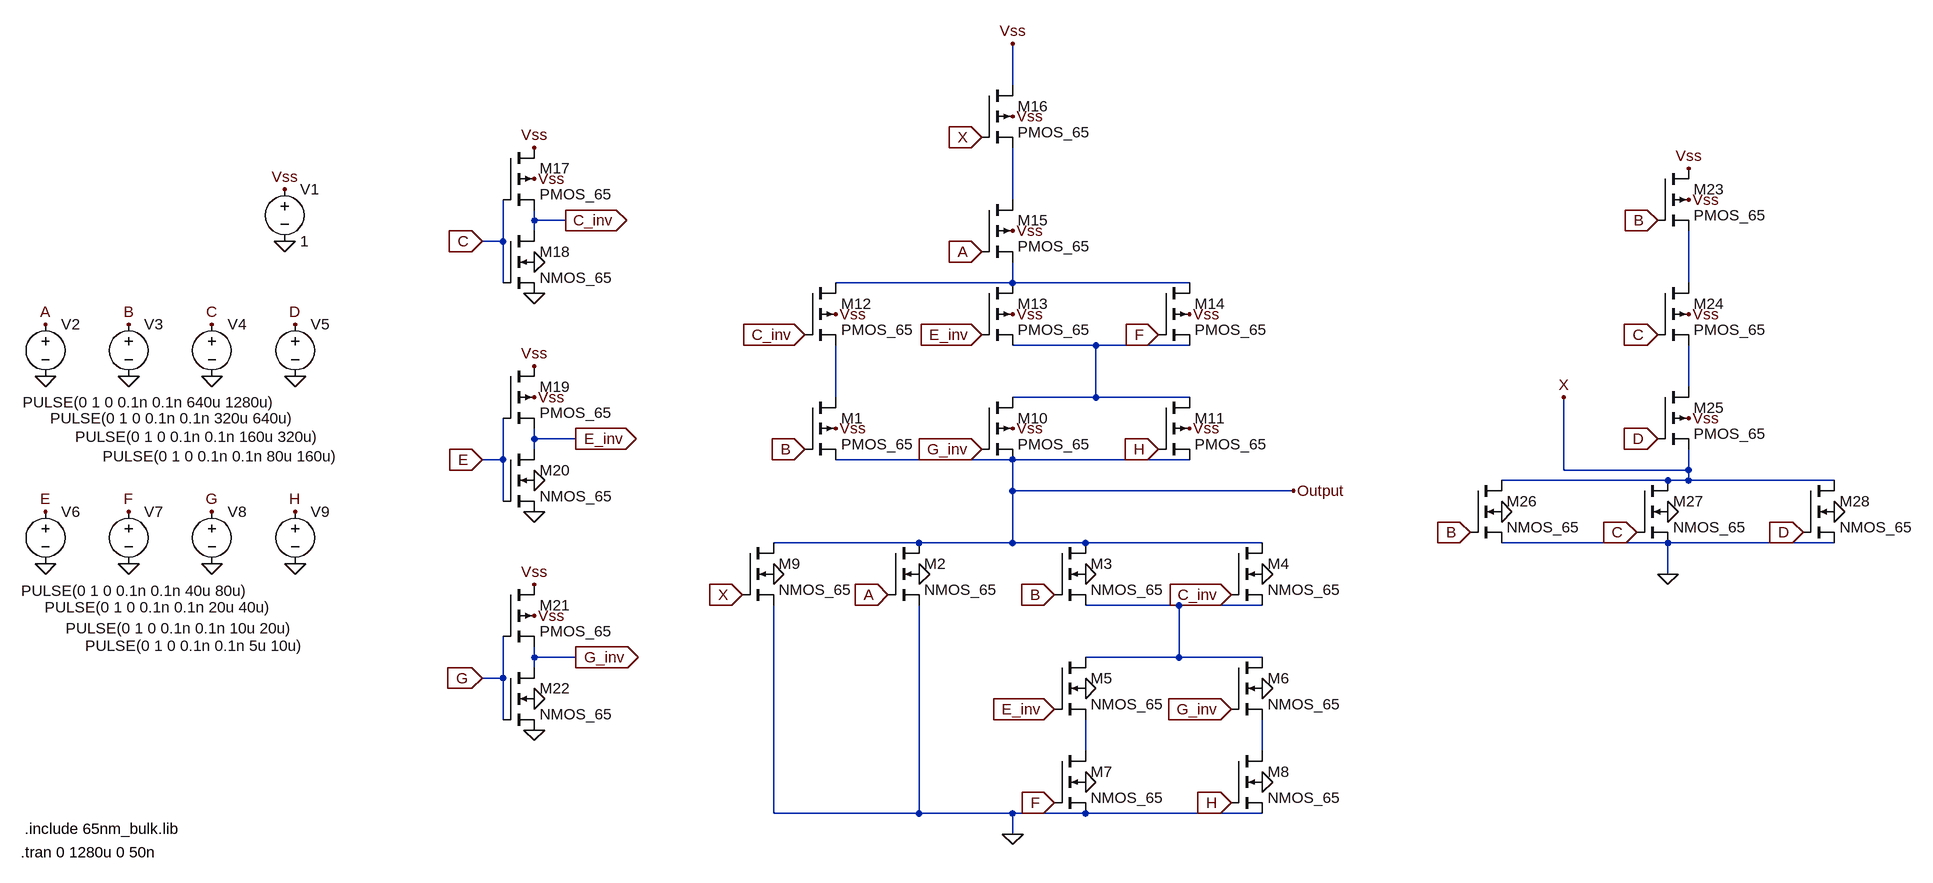
[diagram p0: schematic t_case1.asc]
t_case1.asc, the LTspice schematic file:
Version 4
SHEET 1 1728 924
WIRE 336 -272 336 -336
WIRE 336 -96 336 -176
WIRE -400 -64 -400 -80
WIRE -352 -64 -400 -64
WIRE -400 -48 -400 -64
WIRE -448 -32 -448 -96
WIRE -448 -32 -480 -32
WIRE -448 32 -448 -32
WIRE 336 32 336 0
WIRE 336 32 64 32
WIRE 608 32 336 32
WIRE 1376 32 1376 -48
WIRE 464 128 336 128
WIRE 608 128 464 128
WIRE 1376 192 1376 128
WIRE 64 208 64 128
WIRE 464 208 464 128
WIRE 464 208 336 208
WIRE 608 208 464 208
WIRE -400 272 -400 256
WIRE -336 272 -400 272
WIRE -400 288 -400 272
WIRE -448 304 -448 240
WIRE -448 304 -480 304
WIRE 336 304 64 304
WIRE 608 304 336 304
WIRE 1184 320 1184 208
WIRE 1376 320 1376 288
WIRE 1376 320 1184 320
WIRE 1344 336 1088 336
WIRE 1376 336 1376 320
WIRE 1376 336 1344 336
WIRE 1600 336 1376 336
WIRE 336 352 336 304
WIRE 768 352 336 352
WIRE -448 368 -448 304
WIRE 192 432 -32 432
WIRE 336 432 336 352
WIRE 336 432 192 432
WIRE 448 432 336 432
WIRE 720 432 448 432
WIRE 1344 432 1088 432
WIRE 1600 432 1344 432
WIRE 1344 480 1344 432
WIRE 592 528 448 528
WIRE 720 528 592 528
WIRE -400 608 -400 592
WIRE -336 608 -400 608
WIRE 592 608 592 528
WIRE 592 608 448 608
WIRE 720 608 592 608
WIRE -400 624 -400 608
WIRE -448 640 -448 576
WIRE -448 640 -480 640
WIRE -448 704 -448 640
WIRE 448 752 448 704
WIRE 720 752 720 704
WIRE -32 848 -32 528
WIRE 192 848 192 528
WIRE 192 848 -32 848
WIRE 336 848 192 848
WIRE 448 848 336 848
WIRE 720 848 448 848
WIRE 336 880 336 848
FLAG 64 256 Vss
FLAG 16 288 B
IOPIN 16 288 In
FLAG 192 480 0
FLAG 144 512 A
IOPIN 144 512 In
FLAG 448 480 0
FLAG 400 512 B
IOPIN 400 512 In
FLAG 720 480 0
FLAG 672 512 C_inv
IOPIN 672 512 In
FLAG 448 656 0
FLAG 400 688 E_inv
IOPIN 400 688 In
FLAG 720 656 0
FLAG 672 688 G_inv
IOPIN 672 688 In
FLAG 448 800 0
FLAG 400 832 F
IOPIN 400 832 In
FLAG 720 800 0
FLAG 672 832 H
IOPIN 672 832 In
FLAG -32 480 0
FLAG -80 512 X
IOPIN -80 512 In
FLAG 336 880 0
FLAG 336 256 Vss
FLAG 288 288 G_inv
IOPIN 288 288 In
FLAG 608 256 Vss
FLAG 560 288 H
IOPIN 560 288 In
FLAG 64 80 Vss
FLAG 16 112 C_inv
IOPIN 16 112 In
FLAG 336 80 Vss
FLAG 288 112 E_inv
IOPIN 288 112 In
FLAG 608 80 Vss
FLAG 560 112 F
IOPIN 560 112 In
FLAG 336 -48 Vss
FLAG 288 -16 A
IOPIN 288 -16 In
FLAG 336 -224 Vss
FLAG 288 -192 X
IOPIN 288 -192 In
FLAG -400 -128 Vss
FLAG -400 0 0
FLAG 336 -336 Vss
FLAG -400 -176 Vss
FLAG -400 48 0
FLAG -480 -32 C
IOPIN -480 -32 In
FLAG -400 208 Vss
FLAG -400 336 0
FLAG -400 160 Vss
FLAG -400 384 0
FLAG -480 304 E
IOPIN -480 304 In
FLAG -400 544 Vss
FLAG -400 672 0
FLAG -400 496 Vss
FLAG -400 720 0
FLAG -480 640 G
IOPIN -480 640 In
FLAG 1376 -96 Vss
FLAG 1328 -64 B
IOPIN 1328 -64 In
FLAG 1376 80 Vss
FLAG 1328 112 C
IOPIN 1328 112 In
FLAG 1328 272 D
IOPIN 1328 272 In
FLAG 1088 384 0
FLAG 1040 416 B
IOPIN 1040 416 In
FLAG 1344 384 0
FLAG 1296 416 C
IOPIN 1296 416 In
FLAG 1600 384 0
FLAG 1552 416 D
IOPIN 1552 416 In
FLAG 1344 480 0
FLAG 1376 -144 Vss
FLAG 1184 208 X
FLAG -352 -64 C_inv
IOPIN -352 -64 Out
FLAG -336 272 E_inv
IOPIN -336 272 Out
FLAG -336 608 G_inv
IOPIN -336 608 Out
FLAG -784 -112 Vss
FLAG -784 -32 0
FLAG -1152 96 A
FLAG -1152 176 0
FLAG -1024 96 B
FLAG -1024 176 0
FLAG -896 96 C
FLAG -896 176 0
FLAG -768 96 D
FLAG -768 176 0
FLAG -1152 384 E
FLAG -1152 464 0
FLAG -1024 384 F
FLAG -1024 464 0
FLAG -896 384 G
FLAG -896 464 0
FLAG -768 384 H
FLAG -768 464 0
FLAG 768 352 Output
FLAG 1376 240 Vss
SYMBOL pmos4 16 208 R0
SYMATTR InstName M1
SYMATTR Value2 l=65n w=2600n
SYMATTR Value PMOS_65
SYMBOL nmos4 144 432 R0
SYMATTR InstName M2
SYMATTR Value2 l=65n w=1300n
SYMATTR Value NMOS_65
SYMBOL nmos4 400 432 R0
SYMATTR InstName M3
SYMATTR Value2 l=65n w=1300n
SYMATTR Value NMOS_65
SYMBOL nmos4 672 432 R0
SYMATTR InstName M4
SYMATTR Value2 l=65n w=1300n
SYMATTR Value NMOS_65
SYMBOL nmos4 400 608 R0
SYMATTR InstName M5
SYMATTR Value2 l=65n w=1300n
SYMATTR Value NMOS_65
SYMBOL nmos4 672 608 R0
SYMATTR InstName M6
SYMATTR Value2 l=65n w=1300n
SYMATTR Value NMOS_65
SYMBOL nmos4 400 752 R0
SYMATTR InstName M7
SYMATTR Value2 l=65n w=1300n
SYMATTR Value NMOS_65
SYMBOL nmos4 672 752 R0
SYMATTR InstName M8
SYMATTR Value2 l=65n w=1300n
SYMATTR Value NMOS_65
SYMBOL nmos4 -80 432 R0
SYMATTR InstName M9
SYMATTR Value2 l=65n w=1300n
SYMATTR Value NMOS_65
SYMBOL pmos4 288 208 R0
SYMATTR InstName M10
SYMATTR Value2 l=65n w=2600n
SYMATTR Value PMOS_65
SYMBOL pmos4 560 208 R0
SYMATTR InstName M11
SYMATTR Value2 l=65n w=2600n
SYMATTR Value PMOS_65
SYMBOL pmos4 16 32 R0
SYMATTR InstName M12
SYMATTR Value2 l=65n w=2600n
SYMATTR Value PMOS_65
SYMBOL pmos4 288 32 R0
SYMATTR InstName M13
SYMATTR Value2 l=65n w=2600n
SYMATTR Value PMOS_65
SYMBOL pmos4 560 32 R0
SYMATTR InstName M14
SYMATTR Value2 l=65n w=2600n
SYMATTR Value PMOS_65
SYMBOL pmos4 288 -96 R0
SYMATTR InstName M15
SYMATTR Value2 l=65n w=2600n
SYMATTR Value PMOS_65
SYMBOL pmos4 288 -272 R0
SYMATTR InstName M16
SYMATTR Value2 l=65n w=2600n
SYMATTR Value PMOS_65
SYMBOL pmos4 -448 -176 R0
SYMATTR InstName M17
SYMATTR Value2 l=65n w=2600n
SYMATTR Value PMOS_65
SYMBOL nmos4 -448 -48 R0
SYMATTR InstName M18
SYMATTR Value2 l=65n w=1300n
SYMATTR Value NMOS_65
SYMBOL pmos4 -448 160 R0
SYMATTR InstName M19
SYMATTR Value2 l=65n w=2600n
SYMATTR Value PMOS_65
SYMBOL nmos4 -448 288 R0
SYMATTR InstName M20
SYMATTR Value2 l=65n w=1300n
SYMATTR Value NMOS_65
SYMBOL pmos4 -448 496 R0
SYMATTR InstName M21
SYMATTR Value2 l=65n w=2600n
SYMATTR Value PMOS_65
SYMBOL nmos4 -448 624 R0
SYMATTR InstName M22
SYMATTR Value2 l=65n w=1300n
SYMATTR Value NMOS_65
SYMBOL pmos4 1328 -144 R0
SYMATTR InstName M23
SYMATTR Value2 l=65n w=2600n
SYMATTR Value PMOS_65
SYMBOL pmos4 1328 32 R0
SYMATTR InstName M24
SYMATTR Value2 l=65n w=2600n
SYMATTR Value PMOS_65
SYMBOL pmos4 1328 192 R0
SYMATTR InstName M25
SYMATTR Value2 l=65n w=2600n
SYMATTR Value PMOS_65
SYMBOL nmos4 1040 336 R0
SYMATTR InstName M26
SYMATTR Value2 l=65n w=1300n
SYMATTR Value NMOS_65
SYMBOL nmos4 1296 336 R0
SYMATTR InstName M27
SYMATTR Value2 l=65n w=1300n
SYMATTR Value NMOS_65
SYMBOL nmos4 1552 336 R0
SYMATTR InstName M28
SYMATTR Value2 l=65n w=1300n
SYMATTR Value NMOS_65
SYMBOL voltage -784 -128 R0
WINDOW 123 0 0 Left 0
WINDOW 39 0 0 Left 0
SYMATTR InstName V1
SYMATTR Value 1
SYMBOL voltage -1152 80 R0
WINDOW 123 0 0 Left 0
WINDOW 39 0 0 Left 0
WINDOW 3 -35 136 Left 2
SYMATTR InstName V2
SYMATTR Value PULSE(0 1 0 0.1n 0.1n 640u 1280u)
SYMBOL voltage -1024 80 R0
WINDOW 123 0 0 Left 0
WINDOW 39 0 0 Left 0
WINDOW 3 -121 160 Left 2
SYMATTR InstName V3
SYMATTR Value PULSE(0 1 0 0.1n 0.1n 320u 640u)
SYMBOL voltage -896 80 R0
WINDOW 123 0 0 Left 0
WINDOW 39 0 0 Left 0
WINDOW 3 -210 189 Left 2
SYMATTR InstName V4
SYMATTR Value PULSE(0 1 0 0.1n 0.1n 160u 320u)
SYMBOL voltage -768 80 R0
WINDOW 123 0 0 Left 0
WINDOW 39 0 0 Left 0
WINDOW 3 -296 219 Left 2
SYMATTR InstName V5
SYMATTR Value PULSE(0 1 0 0.1n 0.1n 80u 160u)
SYMBOL voltage -1152 368 R0
WINDOW 123 0 0 Left 0
WINDOW 39 0 0 Left 0
WINDOW 3 -37 138 Left 2
SYMATTR InstName V6
SYMATTR Value PULSE(0 1 0 0.1n 0.1n 40u 80u)
SYMBOL voltage -1024 368 R0
WINDOW 123 0 0 Left 0
WINDOW 39 0 0 Left 0
WINDOW 3 -129 163 Left 2
SYMATTR InstName V7
SYMATTR Value PULSE(0 1 0 0.1n 0.1n 20u 40u)
SYMBOL voltage -896 368 R0
WINDOW 123 0 0 Left 0
WINDOW 39 0 0 Left 0
WINDOW 3 -225 195 Left 2
SYMATTR InstName V8
SYMATTR Value PULSE(0 1 0 0.1n 0.1n 10u 20u)
SYMBOL voltage -768 368 R0
WINDOW 123 0 0 Left 0
WINDOW 39 0 0 Left 0
WINDOW 3 -323 222 Left 2
SYMATTR InstName V9
SYMATTR Value PULSE(0 1 0 0.1n 0.1n 5u 10u)
TEXT -1190 908 Left 2 !.tran 0 1280u 0 50n
TEXT -1184 872 Left 2 !.include 65nm_bulk.lib

The netlist it stands for:
* t_case1.asc
M1 N006 B Output Vss PMOS_65 l=65n w=2600n
M2 Output A 0 0 NMOS_65 l=65n w=1300n
M3 Output B N007 0 NMOS_65 l=65n w=1300n
M4 Output C_inv N007 0 NMOS_65 l=65n w=1300n
M5 N007 E_inv N008 0 NMOS_65 l=65n w=1300n
M6 N007 G_inv N009 0 NMOS_65 l=65n w=1300n
M7 N008 F 0 0 NMOS_65 l=65n w=1300n
M8 N009 H 0 0 NMOS_65 l=65n w=1300n
M9 Output X 0 0 NMOS_65 l=65n w=1300n
M10 N004 G_inv Output Vss PMOS_65 l=65n w=2600n
M11 N004 H Output Vss PMOS_65 l=65n w=2600n
M12 N002 C_inv N006 Vss PMOS_65 l=65n w=2600n
M13 N002 E_inv N004 Vss PMOS_65 l=65n w=2600n
M14 N002 F N004 Vss PMOS_65 l=65n w=2600n
M15 N001 A N002 Vss PMOS_65 l=65n w=2600n
M16 Vss X N001 Vss PMOS_65 l=65n w=2600n
M17 Vss C C_inv Vss PMOS_65 l=65n w=2600n
M18 C_inv C 0 0 NMOS_65 l=65n w=1300n
M19 Vss E E_inv Vss PMOS_65 l=65n w=2600n
M20 E_inv E 0 0 NMOS_65 l=65n w=1300n
M21 Vss G G_inv Vss PMOS_65 l=65n w=2600n
M22 G_inv G 0 0 NMOS_65 l=65n w=1300n
M23 Vss B N003 Vss PMOS_65 l=65n w=2600n
M24 N003 C N005 Vss PMOS_65 l=65n w=2600n
M25 N005 D X Vss PMOS_65 l=65n w=2600n
M26 X B 0 0 NMOS_65 l=65n w=1300n
M27 X C 0 0 NMOS_65 l=65n w=1300n
M28 X D 0 0 NMOS_65 l=65n w=1300n
V1 Vss 0 1
V2 A 0 PULSE(0 1 0 0.1n 0.1n 640u 1280u)
V3 B 0 PULSE(0 1 0 0.1n 0.1n 320u 640u)
V4 C 0 PULSE(0 1 0 0.1n 0.1n 160u 320u)
V5 D 0 PULSE(0 1 0 0.1n 0.1n 80u 160u)
V6 E 0 PULSE(0 1 0 0.1n 0.1n 40u 80u)
V7 F 0 PULSE(0 1 0 0.1n 0.1n 20u 40u)
V8 G 0 PULSE(0 1 0 0.1n 0.1n 10u 20u)
V9 H 0 PULSE(0 1 0 0.1n 0.1n 5u 10u)
.model NMOS NMOS
.model PMOS PMOS
.lib standard.mos
.tran 0 1280u 0 50n
.include 65nm_bulk.lib
.backanno
.end